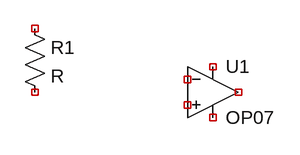
[diagram p0: schematic OP_amp differentiator.asc]
OP_amp differentiator.asc, the LTspice schematic file:
Version 4
SHEET 1 880 680
SYMBOL OpAmps\\OP07 192 96 R0
SYMATTR InstName U1
SYMBOL res -48 64 R0
SYMATTR InstName R1

The netlist it stands for:
* OP_amp differentiator.asc
XU1 NC_01 NC_02 NC_03 NC_04 NC_05 LT1001  ; OP07, pins In+ In- V+ V- OUT
R1 NC_06 NC_07 R
.lib LTC.lib
.backanno
.end